# Altium schematic sheet PmodDA4.SchDoc
size A4
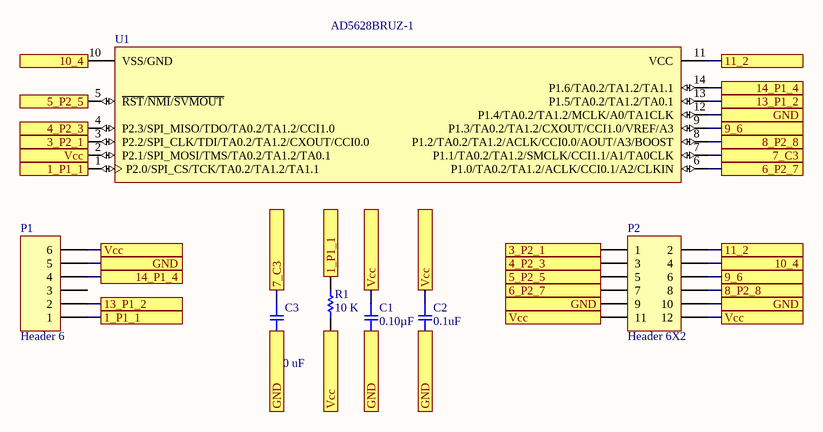
[diagram p0: PmodDA4.SchDoc]

## Parts
C1  0.10µF  [SMD-1206C]
C2  0.1uF  [SMD-1206C]
C3  10 uF  [SMD-1206C]
P1  Header 6  [HDR1X6]
P2  Header 6X2  [HDR2X6]
R1  10 K  [8-1206]
U1  AD5628BRUZ-1  [TI-PW14_N]

## Ports
1_P1_1, 3_P2_1, 4_P2_3, 5_P2_5, 6_P2_7, 7_C3, 8_P2_8, 9_6, 10_4, 11_2, 13_P1_2, 14_P1_4,  14_P1_4, GND, Vcc

## Nets
1_P1_1: P1.1 R1.2 U1.1(P2.0/SPI_CS/TCK/TA0.2/TA1.2/TA1.1) ; port 1_P1_1
3_P2_1: P2.1 U1.3(P2.2/SPI_CLK/TDI/TA0.2/TA1.2/CXOUT/CCI0.0) ; port 3_P2_1
4_P2_3: P2.3 U1.4(P2.3/SPI_MISO/TDO/TA0.2/TA1.2/CCI1.0) ; port 4_P2_3
5_P2_5: P2.5 U1.5(~{RST}/~{NMI}/~{SVMOUT}) ; port 5_P2_5
6_P2_7: P2.7 U1.6(P1.0/TA0.2/TA1.2/ACLK/CCI0.1/A2/CLKIN) ; port 6_P2_7
7_C3: C3.1 U1.7(P1.1/TA0.2/TA1.2/SMCLK/CCI1.1/A1/TA0CLK) ; port 7_C3
8_P2_8: P2.8 U1.8(P1.2/TA0.2/TA1.2/ACLK/CCI0.0/AOUT/A3/BOOST) ; port 8_P2_8
9_6: P2.6 U1.9(P1.3/TA0.2/TA1.2/CXOUT/CCI1.0/VREF/A3) ; port 9_6
10_4: P2.4 U1.10(VSS/GND) ; port 10_4
11_2: P2.2 U1.11(VCC) ; port 11_2
13_P1_2: P1.2 U1.13(P1.5/TA0.2/TA1.2/TA0.1) ; port 13_P1_2
 14_P1_4: P1.4 U1.14(P1.6/TA0.2/TA1.2/TA1.1) ; port  14_P1_4, port 14_P1_4
GND: C1.2 C2.2 C3.2 P1.5 P2.9 P2.10 U1.12(P1.4/TA0.2/TA1.2/MCLK/A0/TA1CLK) ; port GND
Vcc: C1.1 C2.1 P1.6 P2.11 P2.12 R1.1 U1.2(P2.1/SPI_MOSI/TMS/TA0.2/TA1.2/TA0.1) ; port Vcc

Not connected (* = marked no-connect by the designer): P1 3

## Library data of the parts
C1 = LLM315R71C104MA11L: CAP CER 0.1UF 16V X7R 1206; Manufacturer: Murata Electronics North America; Factory Stock: 0; Unit Price (USD): 0.9; Minimum Quantity: 1; Tolerance: ±20%; Datasheets: http://www.murata.com/~/media/webrenewal/support/library/catalog/products/capacitor/mlcc/c02e.pdf; Image: //media.digikey.com/Renders/Murata%20Renders/1206(LLM315).jpg; Digi-Key Part Number: 490-4495-1-ND; Part Number: LLM315R71C104MA11L; Quantity Available: 2915; @ qty: 0; Packaging: Cut Tape (CT); Series: LLM; Part Status: Active; Value: 0.10µF; Voltage: 16V; Temperature Coefficient: X7R; Operating Temperature: -55°C ~ 125°C; Features: Low ESL (Multi-Terminal); Ratings: -; Applications: Bypass, Decoupling; Mounting Type: Surface Mount, MLCC; Package / Case: 1206 (3216 Metric); Size / Dimension: 0.126" L x 0.063" W (3.20mm x 1.60mm); Height - Seated (Max): -; Thickness (Max): 0.022" (0.55mm); Lead Spacing: -; Lead Style: -
C2 C3 = LLM315R71C104MA11L: CAP CER 0.1UF 16V X7R 1206; Manufacturer: Murata Electronics North America; Factory Stock: 0; Unit Price (USD): 0.9; Minimum Quantity: 1; Value: 0.10µF; Tolerance: ±20%; Datasheets: http://www.murata.com/~/media/webrenewal/support/library/catalog/products/capacitor/mlcc/c02e.pdf; Image: //media.digikey.com/Renders/Murata%20Renders/1206(LLM315).jpg; Digi-Key Part Number: 490-4495-1-ND; Part Number: LLM315R71C104MA11L; Quantity Available: 2915; @ qty: 0; Packaging: Cut Tape (CT); Series: LLM; Part Status: Active; Voltage: 16V; Temperature Coefficient: X7R; Operating Temperature: -55°C ~ 125°C; Features: Low ESL (Multi-Terminal); Ratings: -; Applications: Bypass, Decoupling; Mounting Type: Surface Mount, MLCC; Package / Case: 1206 (3216 Metric); Size / Dimension: 0.126" L x 0.063" W (3.20mm x 1.60mm); Height - Seated (Max): -; Thickness (Max): 0.022" (0.55mm); Lead Spacing: -; Lead Style: -
P1 = Header 6: Header, 6-Pin; LatestRevisionDate: 17-Jul-2002; LatestRevisionNote: Re-released for DXP Platform.; Publisher: Altium Limited
P2 = Header 6X2: Header, 6-Pin, Dual row; LatestRevisionDate: 17-Jul-2002; LatestRevisionNote: Re-released for DXP Platform.; Publisher: Altium Limited
R1 = ERJP08J: Anti-Surge Thick Film Chip Resistor, 10 Ohm to 1M Ohm Range, 5% Tolerance, 1206 Size, 0.25 W; Note: If flow soldering, adjust pad width of PCB Footprint to 0.7 - 0.8 times the width of the resistor.; Published: 17-Dec-2003; LatestRevisionDate: 19-Mar-2004; LatestRevisionNote: Silkscreen size reduced.; PackageDocument: Mar-2003; PackageReference: 8-1206; Publisher: Altium Limited; Code_IPC: 3216 [1206]; ComponentLink1Description: Manufacturer Link; ComponentLink1URL: http://www.panasonic.com/industrial/components/resistive_products.htm; ComponentLink2Description: Datasheet; ComponentLink2URL: http://www.panasonic.com/industrial/components/pdf/AOA0000CE4.pdf
U1 = MSP430L092SPW: 4 MHz Mixed Signal Microcontroller with 2048 B SRAM and 11 GPIOs, 0 to 50 degC, 14-pin SOP (PW), Green (RoHS & no Sb/Br); Manufacturer: Texas Instruments; ADC: 8-bit SAR; ADC Channels: 4; Brown Out Reset: Yes; GPIO: 11; SRAM(B): 2048; SubFamily: Low Voltage Series; Timers - 16-bit: 2; DatasheetVersion: SLAS673; PackageVersion: 4040064-3/G; PackageReference: PW14; PackageDescription: 14-Pin Plastic Small Outline, Body 5 x 4.4 mm, 0.65 mm Pitch; Supplier 1: Digi-Key; Supplier Part Number 1: 296-32177-2-ND; Supplier 2: Digi-Key; Supplier Part Number 2: 296-32177-1-ND; Supplier 3: Digi-Key; Supplier Part Number 3: 296-32177-6-ND; Supplier 4: Farnell; Supplier Part Number 4: 1903590; Supplier 5: Newark; Supplier Part Number 5: 48T4379; Supplier 6: Mouser; Supplier Part Number 6: 595-P430G2553IRHB32T; Comparators: Yes; Eco-Plan: Green (RoHS & no Sb/Br); Frequency(MHz): 4; SVS: Yes; Temp Sensor: Yes; Watchdog: Yes; Mounting Technology: Surface Mount; Code_JEDEC: MO-153; PartNumber: MSP430L092SPW; ComponentLink1Description: Manufacturer URL; ComponentLink1URL: http://www.ti.com/; ComponentLink2Description: Datasheet; ComponentLink2URL: http://www.ti.com/general/docs/lit/getliterature.tsp?genericPartNumber=MSP430L092&fileType=pdf; ComponentLink3Description: Package Specification; ComponentLink3URL: http://www.ti.com/litv/pdf/mpds360